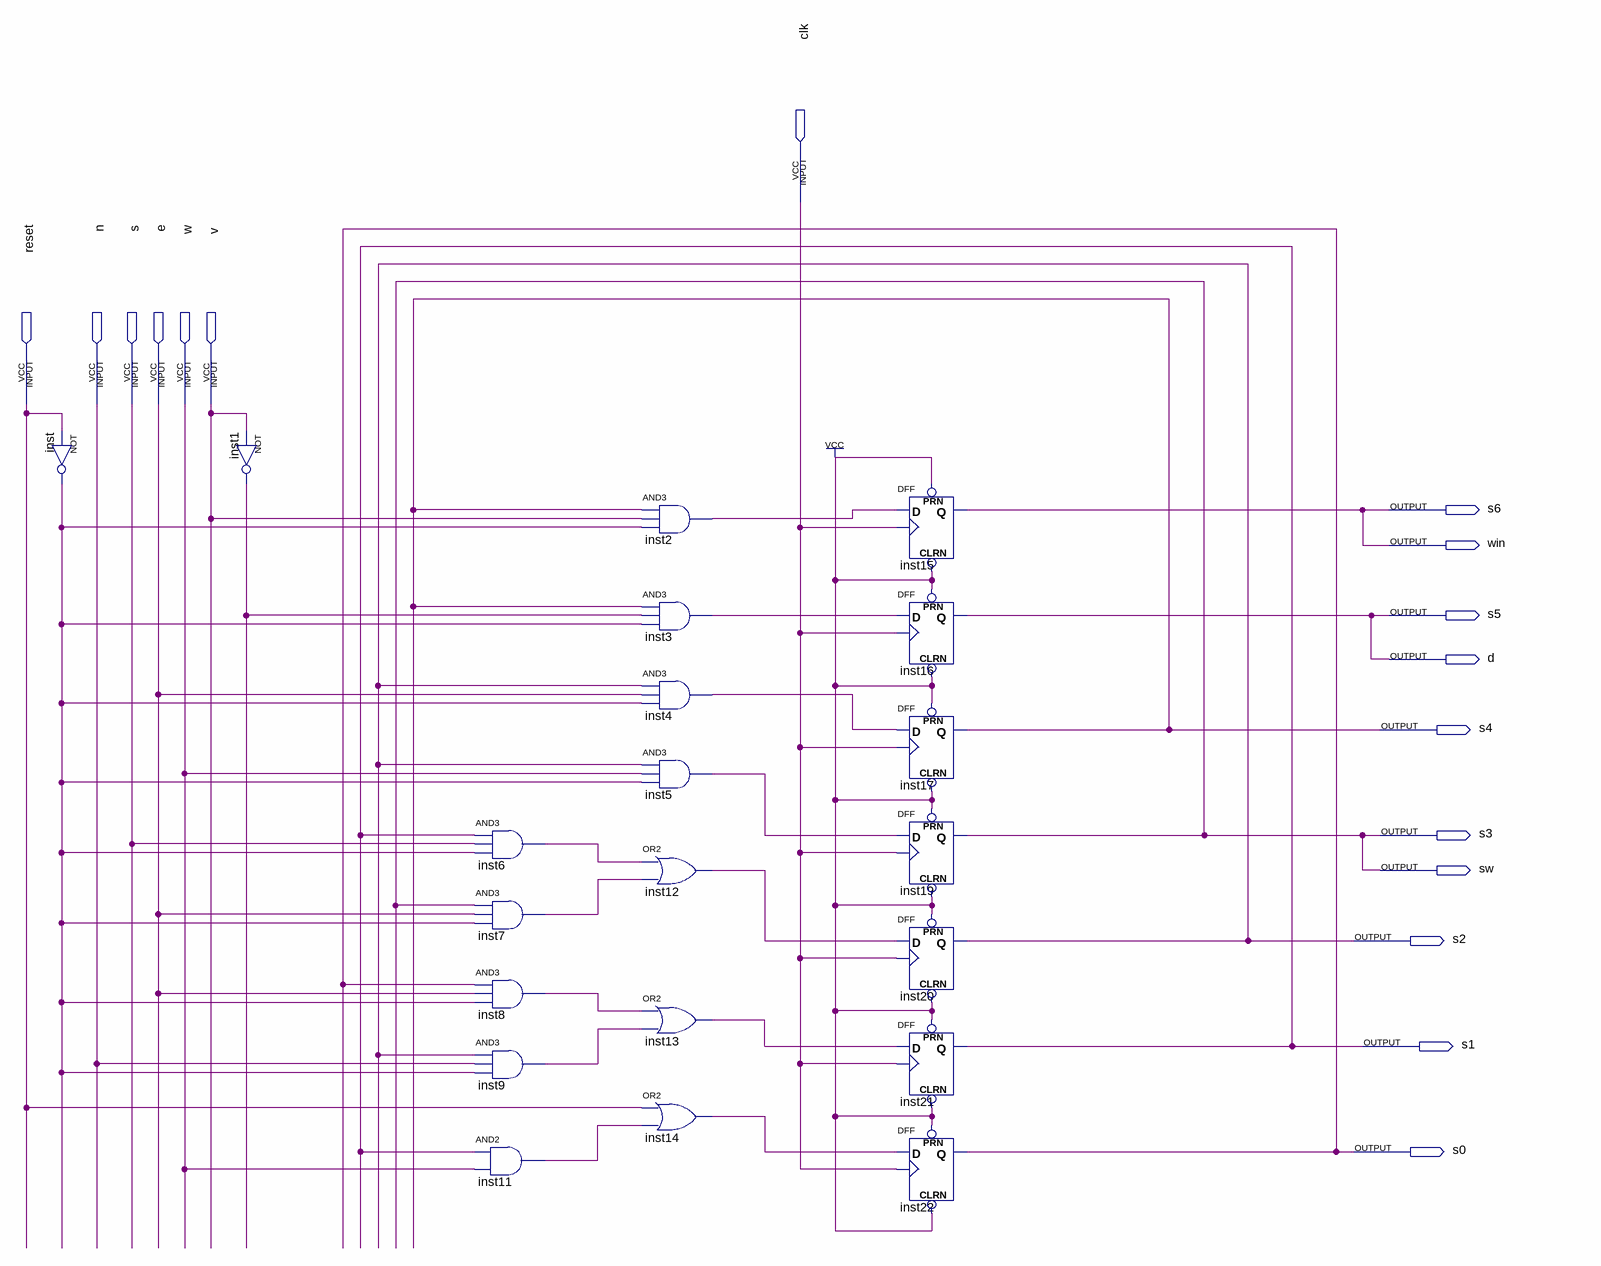
[diagram p0: schematic sheet]
// Quartus schematic room.bdf as structural Verilog: 21 symbols, 17 pins
module room (
  input  clk,
  input  reset,
  input  n,
  input  s,
  input  e,
  input  w,
  input  v,
  output s6,
  output win,
  output s5,
  output d,
  output s4,
  output s3,
  output sw,
  output s2,
  output s1,
  output s0
);

  wire inst1_out, inst2_out, inst3_out, inst4_out, inst5_out, inst6_out, inst7_out, inst8_out, inst9_out,
       inst11_out, inst12_out, inst13_out, inst14_out, inst_out;

  not inst (inst_out, reset);
  not inst1 (inst1_out, v);
  and inst6 (inst6_out, s1, s, inst_out);
  and inst7 (inst7_out, s3, e, inst_out);
  and inst8 (inst8_out, s0, e, inst_out);
  and inst9 (inst9_out, s2, n, inst_out);
  and inst11 (inst11_out, s1, w);
  and inst2 (inst2_out, s4, v, inst_out);
  and inst3 (inst3_out, s4, inst1_out, inst_out);
  and inst4 (inst4_out, s2, e, inst_out);
  and inst5 (inst5_out, s2, w, inst_out);
  or inst12 (inst12_out, inst6_out, inst7_out);
  or inst13 (inst13_out, inst8_out, inst9_out);
  or inst14 (inst14_out, reset, inst11_out);
  DFF inst15 (.CLRN(1'b1), .CLK(clk), .D(inst2_out), .PRN(1'b1), .Q(s6));
  DFF inst16 (.CLRN(1'b1), .CLK(clk), .D(inst3_out), .PRN(1'b1), .Q(d));
  DFF inst17 (.CLRN(1'b1), .CLK(clk), .D(inst4_out), .PRN(1'b1), .Q(s4));
  DFF inst19 (.CLRN(1'b1), .CLK(clk), .D(inst5_out), .PRN(1'b1), .Q(s3));
  DFF inst20 (.CLRN(1'b1), .CLK(clk), .D(inst12_out), .PRN(1'b1), .Q(s2));
  DFF inst21 (.CLRN(1'b1), .CLK(clk), .D(inst13_out), .PRN(1'b1), .Q(s1));
  DFF inst22 (.CLRN(1'b1), .CLK(clk), .D(inst14_out), .PRN(1'b1), .Q(s0));

  assign s5 = d;
  assign sw = s3;
  assign win = s6;
endmodule
